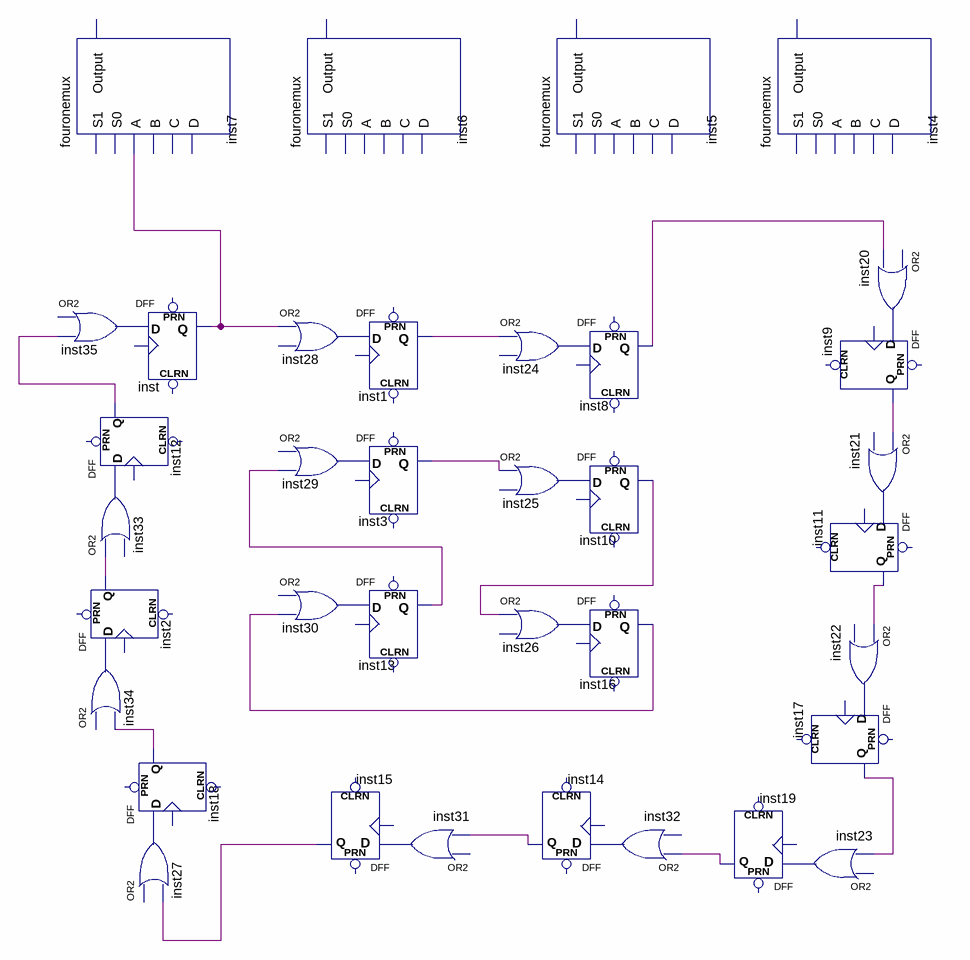
[diagram p0: schematic sheet]
// Quartus schematic Userblock.bdf as structural Verilog: 36 symbols, 0 pins
module Userblock (
);

  wire inst1_q, inst2_q, inst3_q, inst8_q, inst9_q, inst10_q, inst11_q, inst12_q, inst13_q, inst14_q,
       inst15_q, inst16_q, inst17_q, inst18_q, inst19_q, inst20_out, inst21_out, inst22_out, inst23_out,
       inst24_out, inst25_out, inst26_out, inst27_out, inst28_out, inst29_out, inst30_out, inst31_out,
       inst32_out, inst33_out, inst34_out, inst35_out, inst_q;

  fouronemux inst7 (.A(inst_q));  // open: S1, S0, B, C, D, Output
  buf inst35 (inst35_out, inst12_q);  // OR2 open: IN1
  DFF inst (.D(inst35_out), .Q(inst_q));  // open: CLRN, CLK, PRN
  DFF inst12 (.D(inst33_out), .Q(inst12_q));  // open: CLRN, CLK, PRN
  buf inst33 (inst33_out, inst2_q);  // OR2 open: IN2
  DFF inst2 (.D(inst34_out), .Q(inst2_q));  // open: CLRN, CLK, PRN
  buf inst34 (inst34_out, inst18_q);  // OR2 open: IN1
  DFF inst18 (.D(inst27_out), .Q(inst18_q));  // open: CLRN, CLK, PRN
  buf inst27 (inst27_out, inst15_q);  // OR2 open: IN1
  fouronemux inst6 ();  // open: S1, S0, A, B, C, D, Output
  buf inst28 (inst28_out, inst_q);  // OR2 open: IN2
  buf inst29 (inst29_out, inst13_q);  // OR2 open: IN1
  buf inst30 (inst30_out, inst16_q);  // OR2 open: IN1
  DFF inst1 (.D(inst28_out), .Q(inst1_q));  // open: CLRN, CLK, PRN
  DFF inst3 (.D(inst29_out), .Q(inst3_q));  // open: CLRN, CLK, PRN
  DFF inst13 (.D(inst30_out), .Q(inst13_q));  // open: CLRN, CLK, PRN
  DFF inst15 (.D(inst31_out), .Q(inst15_q));  // open: CLRN, CLK, PRN
  buf inst31 (inst31_out, inst14_q);  // OR2 open: IN1
  buf inst24 (inst24_out, inst1_q);  // OR2 open: IN2
  buf inst25 (inst25_out, inst3_q);  // OR2 open: IN2
  buf inst26 (inst26_out, inst10_q);  // OR2 open: IN2
  fouronemux inst5 ();  // open: S1, S0, A, B, C, D, Output
  DFF inst8 (.D(inst24_out), .Q(inst8_q));  // open: CLRN, CLK, PRN
  DFF inst10 (.D(inst25_out), .Q(inst10_q));  // open: CLRN, CLK, PRN
  DFF inst16 (.D(inst26_out), .Q(inst16_q));  // open: CLRN, CLK, PRN
  DFF inst14 (.D(inst32_out), .Q(inst14_q));  // open: CLRN, CLK, PRN
  buf inst32 (inst32_out, inst19_q);  // OR2 open: IN2
  DFF inst19 (.D(inst23_out), .Q(inst19_q));  // open: CLRN, CLK, PRN
  fouronemux inst4 ();  // open: S1, S0, A, B, C, D, Output
  DFF inst9 (.D(inst20_out), .Q(inst9_q));  // open: CLRN, CLK, PRN
  DFF inst11 (.D(inst21_out), .Q(inst11_q));  // open: CLRN, CLK, PRN
  DFF inst17 (.D(inst22_out), .Q(inst17_q));  // open: CLRN, CLK, PRN
  buf inst23 (inst23_out, inst17_q);  // OR2 open: IN1
  buf inst20 (inst20_out, inst8_q);  // OR2 open: IN1
  buf inst21 (inst21_out, inst9_q);  // OR2 open: IN2
  buf inst22 (inst22_out, inst11_q);  // OR2 open: IN2
endmodule
